# Altium project Battery_Board.PrjPcb
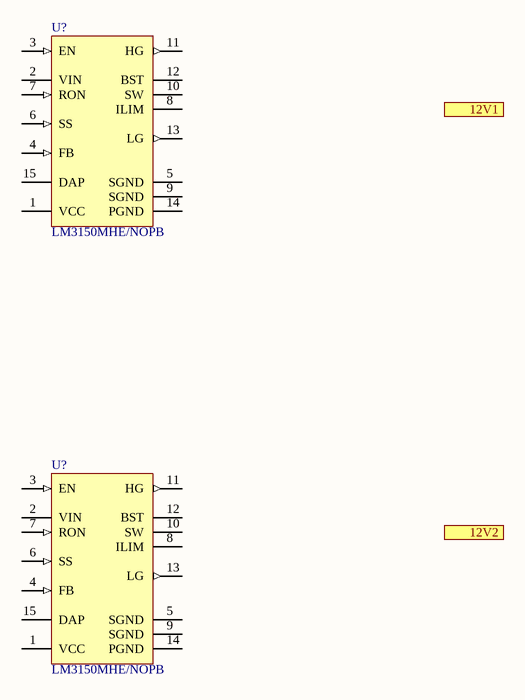
[diagram p0: 12V_Regulators.SchDoc]
6 sheets, 26 parts. Net scope: flat (ports and power ports of the same name join across sheets).
Sheets:
  BatteryBoardInterface.SchDoc
  12V_Regulators.SchDoc
  MCU.SchDoc
  BatteryProtection.SchDoc
  BatteryCharger.SchDoc
  IdealDiode.SchDoc

## Sheet BatteryBoardInterface.SchDoc
size A

## Sheet 12V_Regulators.SchDoc
size A

### Parts
(Parts that share a designator on the sheet are numbered #1, #2 ... from top to bottom, then left to right.)
U?#1  LM3150MHE/NOPB  [PWP0014A_L]
U?#2  LM3150MHE/NOPB  [PWP0014A_L]

### Ports
12V1 (out), 12V2 (out)

### Nets

Not connected (* = marked no-connect by the designer): U?#1 1(VCC) 2(VIN) 3(EN) 4(FB) 5(SGND) 6(SS) 7(RON) 8(ILIM) 9(SGND) 10(SW) 11(HG) 12(BST) 13(LG) 14(PGND) 15(DAP); U?#2 1(VCC) 2(VIN) 3(EN) 4(FB) 5(SGND) 6(SS) 7(RON) 8(ILIM) 9(SGND) 10(SW) 11(HG) 12(BST) 13(LG) 14(PGND) 15(DAP)

### Library data of the parts
U?#1 U?#2 = CMP-0069-01799-3: SIMPLE SWITCHER® CONTROLLER, 42V Synchronous Step-Down, 14-pin TSSOP-EP, Pb-Free; Manufacturer: Texas Instruments; PackageTopMarking: NSUZXYTT*LM3150*MH; PowerWise: Y; ComponentLink1URL: http://www.ti.com/general/docs/lit/getliterature.tsp?genericPartNumber=LM3150&fileType=pdf; PinCount: 14; RoHS: Y; PackageDescription: Molded TSSOP, JEDEC, Exposed Pad, 5.0 x 4.4 x 0.9mm Body, 14 Lead, 0.65mm Pitch; ComponentLink1Description: Datasheet URL; CompType: Switcher; PackageReference: PWP0014A; Code_JEDEC: MO-153-ABT-1

## Sheet MCU.SchDoc
size A
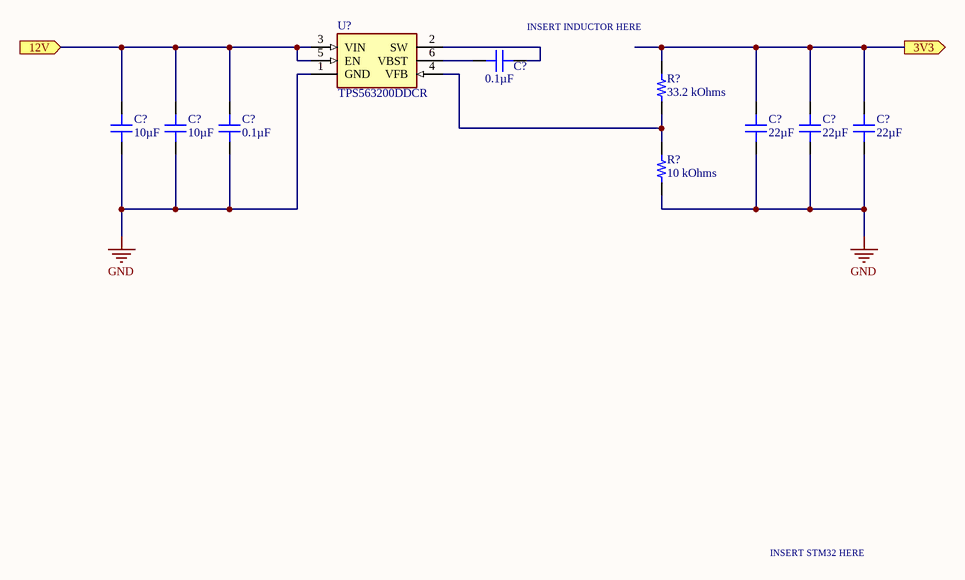
[diagram p1: MCU.SchDoc]

### Parts
(Parts that share a designator on the sheet are numbered #1, #2 ... from top to bottom, then left to right.)
C?#1  0.1µF  [CAP 0805_2012]
C?#2  10µF  [CAP 0805_2012]
C?#3  10µF  [CAP 0805_2012]
C?#4  0.1µF  [CAP 0805_2012]
C?#5  22µF  [CAP 0805_2012]
C?#6  22µF  [CAP 0805_2012]
C?#7  22µF  [CAP 0805_2012]
R?#1  33.2 kOhms  [RES 0603_1608]
R?#2  10 kOhms  [RES 0603_1608]
U?#3  TPS563200DDCR  [SOT95P280X110-6N]

### Ports
3V3 (out), 12V (in)

### Nets
GND: C?#2.1 C?#3.1 C?#4.1 C?#5.1 C?#6.1 C?#7.1 R?#2.1 U?#3.1(GND)
NetC?#1_1: C?#1.1 U?#3.6(VBST)
NetC?#1_2: C?#1.2 U?#3.2(SW)
NetC?#2_2: C?#2.2 C?#3.2 C?#4.2 U?#3.3(VIN) U?#3.5(EN) ; port 12V
NetC?#5_2: C?#5.2 C?#6.2 C?#7.2 R?#1.2 ; port 3V3
NetR?#1_1: R?#1.1 R?#2.2 U?#3.4(VFB)

### Notes on the sheet
- (near C?#1) INSERT INDUCTOR HERE
- INSERT STM32 HERE

### Library data of the parts
C?#1 C?#4 = UMK212B7104KG-T: CAP CER 0.1UF 50V X7R 0805; Manufacturer: Taiyo Yuden; Tolerance: ±10%; Part Number: UMK212B7104KG-T; Value: 0.1µF; Applications: General Purpose; Capacitance: 0.1µF; ComponentLink1Description: Datasheet; ComponentLink1URL: https://www.yuden.co.jp/productdata/catalog/mlcc01_e.pdf; ComponentLink2Description: DigiKey Link; ComponentLink2URL: http://digikey.com/product-detail/en/taiyo-yuden/UMK212B7104KG-T/587-1279-1-ND/931056; Device Package: 0805 (2012 Metric); LastUpdated: 1/21/2020 12:03:02 AM; Lifecycle Status: Active; Minimum Order: 1; Mounting Type: Surface Mount, MLCC; Operating Temperature: -55°C ~ 125°C; Package / Case: 0805 (2012 Metric); Packaging: TapeAndReel; PartId: 4985; Part Status: Active; Price: 0.02; Series: M; Size / Dimension: 0.079" L x 0.049" W (2.00mm x 1.25mm); Supplier 1: DigiKey; Supplier Part Number 1: 587-1279-1-ND; Temperature Coefficient: X7R; Thickness (Max): 0.053" (1.35mm); Voltage - Rated: 50V
C?#2 C?#3 = TMK212BBJ106KGHT: CAP CER 10UF 25V X5R 0805; Manufacturer: Taiyo Yuden; Tolerance: ±10%; Part Number: TMK212BBJ106KGHT; Value: 10µF; Applications: Automotive; Capacitance: 10µF; ComponentLink1Description: Datasheet; ComponentLink1URL: https://www.yuden.co.jp/productdata/catalog/mlcc_all_hq_e.pdf; ComponentLink2Description: DigiKey Link; ComponentLink2URL: http://digikey.com/product-detail/en/taiyo-yuden/TMK212BBJ106KGHT/587-4334-1-ND/5400908; Device Package: 0805 (2012 Metric); LastUpdated: 1/21/2020 12:03:03 AM; Lifecycle Status: Active; Minimum Order: 1; Mounting Type: Surface Mount, MLCC; Operating Temperature: -55°C ~ 85°C; Package / Case: 0805 (2012 Metric); Packaging: TapeAndReel; PartId: 4818; Part Status: Active; Price: 0.07; Ratings: AEC-Q200; Series: M; Size / Dimension: 0.079" L x 0.049" W (2.00mm x 1.25mm); Supplier 1: DigiKey; Supplier Part Number 1: 587-4334-1-ND; Temperature Coefficient: X5R; Thickness (Max): 0.053" (1.35mm); Voltage - Rated: 25V
C?#5-C?#7 = LMK212BBJ226MG-T: CAP CER 22UF 10V X5R 0805; Manufacturer: Taiyo Yuden; Tolerance: ±20%; Part Number: LMK212BBJ226MG-T; Value: 22µF; Applications: SMPS Filtering; Capacitance: 22µF; ComponentLink1Description: Datasheet; ComponentLink1URL: https://ds.yuden.co.jp/TYCOMPAS/ut/detail?pn=LMK212BBJ226MG-T &u=M; ComponentLink2Description: DigiKey Link; ComponentLink2URL: http://digikey.com/product-detail/en/taiyo-yuden/LMK212BBJ226MG-T/587-5464-1-ND/7067140; Device Package: 0805 (2012 Metric); LastUpdated: 1/21/2020 12:02:43 AM; Lifecycle Status: Active; Minimum Order: 1; Mounting Type: Surface Mount, MLCC; Operating Temperature: -55°C ~ 85°C; Package / Case: 0805 (2012 Metric); Packaging: TapeAndReel; PartId: 16243; Part Status: Active; Price: 0.06; Series: M; Size / Dimension: 0.079" L x 0.049" W (2.00mm x 1.25mm); Supplier 1: DigiKey; Supplier Part Number 1: 587-5464-1-ND; Temperature Coefficient: X5R; Thickness (Max): 0.057" (1.45mm); Voltage - Rated: 10V
R?#1 = RT0603FRE0733K2L: RES SMD 33.2K OHM 1% 1/10W 0603; Manufacturer: Yageo; Power (Watts): 0.1W, 1/10W; Temperature Coefficient: ±50ppm/°C; Part Number: RT0603FRE0733K2L; Value: 33.2 kOhms; ComponentLink1Description: Datasheet; ComponentLink1URL: https://www.yageo.com/upload/media/product/productsearch/datasheet/rchip/PYu-RT_1-to-0.01_RoHS_L_11.pdf; ComponentLink2Description: DigiKey Link; ComponentLink2URL: http://digikey.com/product-detail/en/yageo/RT0603FRE0733K2L/YAG5958CT-ND/9370988; Composition: Thin Film; Device Package: 0603 (1608 Metric); Height - Seated (Max): 0.022" (0.55mm); LastUpdated: 1/21/2020 12:20:29 AM; Lifecycle Status: Active; Minimum Order: 1; Number of Terminations: 2; Operating Temperature: -55°C ~ 155°C; Package / Case: 0603 (1608 Metric); Packaging: TapeAndReel; PartId: 16004; Part Status: Active; Price: 0.01; Resistance: 33.2 kOhms; Series: RT; Size / Dimension: 0.063" L x 0.031" W (1.60mm x 0.80mm); Supplier 1: DigiKey; Supplier Part Number 1: YAG5958CT-ND; Supplier Device Package: 0603; Tolerance: ±1%
R?#2 = TNPW060310K0FHTA: RES 10K OHM 1% 1/10W 0603; Manufacturer: Vishay Dale; Power (Watts): 0.1W, 1/10W; Temperature Coefficient: ±50ppm/°C; Part Number: TNPW060310K0FHTA; Value: 10 kOhms; ComponentLink2Description: DigiKey Link; ComponentLink2URL: http://digikey.com/product-detail/en/vishay-dale/TNPW060310K0FHTA/541-3906-1-ND/7355264; Composition: Thin Film; Device Package: 0603 (1608 Metric); Features: Military; Height - Seated (Max): 0.022" (0.55mm); LastUpdated: 1/21/2020 12:23:11 AM; Lifecycle Status: Active; Minimum Order: 1; Number of Terminations: 2; Operating Temperature: -55°C ~ 125°C; Package / Case: 0603 (1608 Metric); Packaging: TapeAndReel; PartId: 9361; Part Status: Active; Price: 0.07; Resistance: 10 kOhms; Series: TNPW; Size / Dimension: 0.063" L x 0.033" W (1.60mm x 0.85mm); Supplier 1: DigiKey; Supplier Part Number 1: 541-3906-1-ND; Supplier Device Package: 0603; Tolerance: ±1%
U?#3 = TPS563200DDCR: Buck Switching Regulator IC Positive Adjustable 0.76V 1 Output 3A SOT-23-6 Thin, TSOT-23-6; MF: Texas Instruments; Package: TSOT-23 Texas Instruments; Value: *; Price: None; MP: TPS563200DDCR; SnapEDA_Link: https://www.snapeda.com/parts/TPS563200DDCR/Texas%20Instruments/view-part/71685/?ref=snap; Availability: Unavailable

## Sheet BatteryProtection.SchDoc
size A

## Sheet BatteryCharger.SchDoc
size B
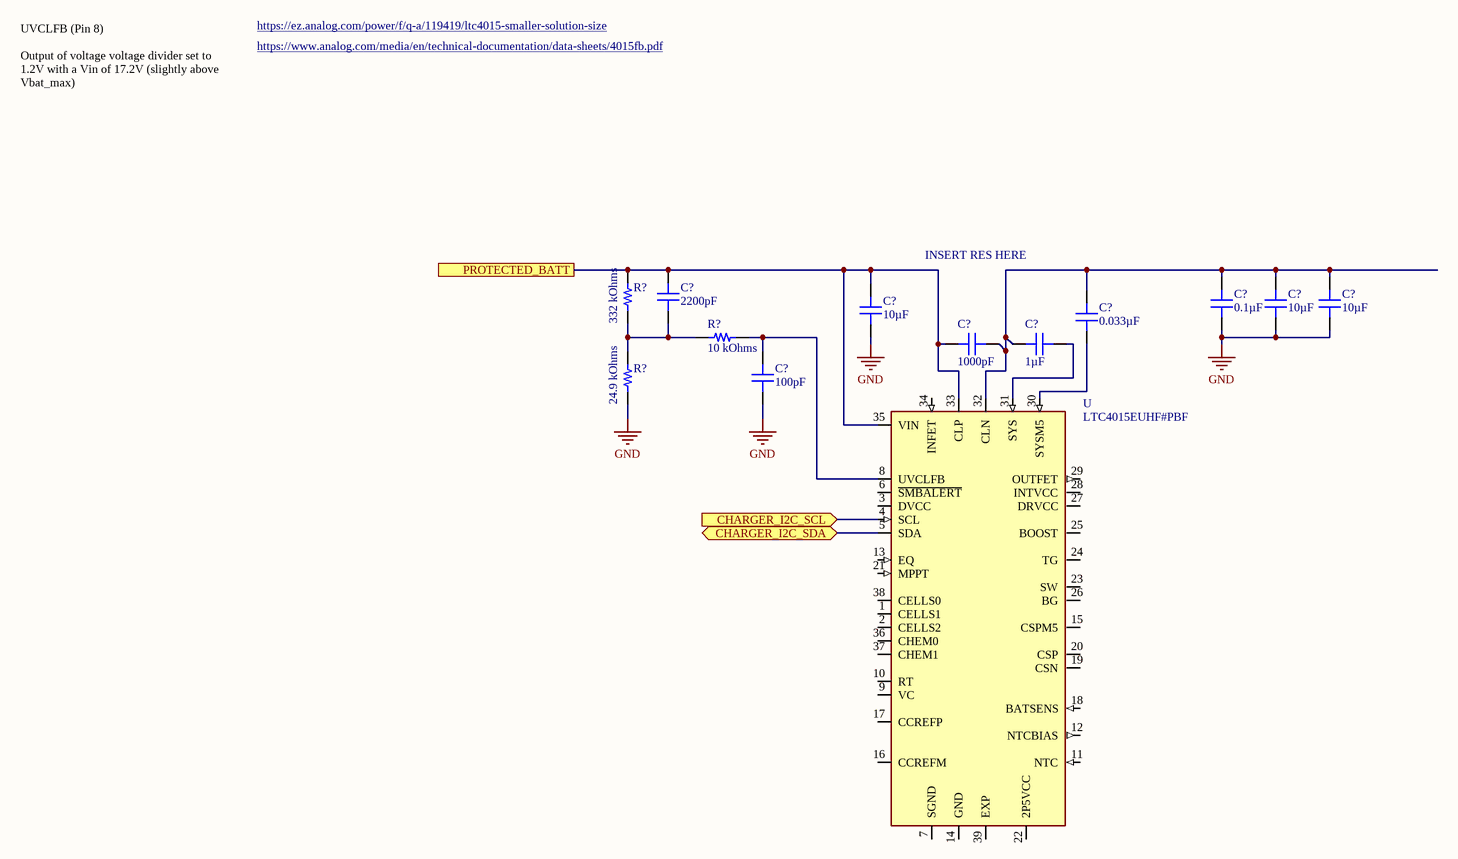
[diagram p2: BatteryCharger.SchDoc]

### Parts
(Parts that share a designator on the sheet are numbered #1, #2 ... from top to bottom, then left to right.)
C?#8  2200pF  [CAP 0603_1608]
C?#9  0.1µF  [CAP 0603_1608]
C?#10  10µF  [CAP 0805_2012]
C?#11  10µF  [CAP 0805_2012]
C?#12  10µF  [CAP 0805_2012]
C?#13  0.033µF  [CAP 0603_1608]
C?#14  1000pF  [CAP 0603_1608]
C?#15  1µF  [CAP 0603_1608]
C?#16  100pF  [CAP 0603_1608]
R?#3  332 kOhms  [RES 0603_1608]
R?#4  10 kOhms  [RES 0603_1608]
R?#5  24.9 kOhms  [RES 0603_1608]
U  LTC4015EUHF#PBF  [QFN50P700X500X80-39N]

### Ports
CHARGER_I2C_SCL (in), CHARGER_I2C_SDA (bidir), PROTECTED_BATT

### Nets
GND: C?#9.1 C?#10.1 C?#11.1 C?#12.1 C?#16.1 R?#5.1
NetC?#8_1: C?#8.1 R?#3.1 R?#4.1 R?#5.2
NetC?#8_2: C?#8.2 C?#12.2 C?#14.1 R?#3.2 U.33(CLP) U.35(VIN) ; port PROTECTED_BATT
NetC?#9_2: C?#9.2 C?#10.2 C?#11.2 C?#13.2 C?#14.2 C?#15.1 U.32(CLN)
NetC?#13_1: C?#13.1 U.30(SYSM5)
NetC?#15_2: C?#15.2 U.31(SYS)
NetC?#16_2: C?#16.2 R?#4.2 U.8(UVCLFB)
NetU_4: U.4(SCL) ; port CHARGER_I2C_SCL
NetU_5: U.5(SDA) ; port CHARGER_I2C_SDA

Not connected (* = marked no-connect by the designer): U 1(CELLS1) 2(CELLS2) 3(DVCC) 6(~{SMBALERT}) 7(SGND) 9(VC) 10(RT) 11(NTC) 12(NTCBIAS) 13(EQ) 14(GND) 15(CSPM5) 16(CCREFM) 17(CCREFP) 18(BATSENS) 19(CSN) 20(CSP) 21(MPPT) 22(2P5VCC) 23(SW) 24(TG) 25(BOOST) 26(BG) 27(DRVCC) 28(INTVCC) 29(OUTFET) 34(INFET) 36(CHEM0) 37(CHEM1) 38(CELLS0) 39(EXP)

### Notes on the sheet
- https://ez.analog.com/power/f/q-a/119419/ltc4015-smaller-solution-size
- https://www.analog.com/media/en/technical-documentation/data-sheets/4015fb.pdf
- UVCLFB (Pin 8)
  Output of voltage voltage divider set to 1.2V with a Vin of 17.2V (slightly above Vbat_max)
- INSERT RES HERE

### Library data of the parts
C?#8 = VJ0603Y222KXACW1BC: CAP CER 2200PF 50V X7R 0603; Manufacturer: Vishay Vitramon; Tolerance: ±10%; Part Number: VJ0603Y222KXACW1BC; Value: 2200pF; Applications: General Purpose; Capacitance: 2200pF; ComponentLink1Description: Datasheet; ComponentLink1URL: https://www.vishay.com/docs/28548/vjw1bcbascomseries.pdf; ComponentLink2Description: DigiKey Link; ComponentLink2URL: http://digikey.com/product-detail/en/vishay-vitramon/VJ0603Y222KXACW1BC/720-1600-1-ND/421005; Device Package: 0603 (1608 Metric); LastUpdated: 1/21/2020 12:01:49 AM; Lifecycle Status: Active; Minimum Order: 1; Mounting Type: Surface Mount, MLCC; Operating Temperature: -55°C ~ 125°C; Package / Case: 0603 (1608 Metric); Packaging: TapeAndReel; PartId: 14237; Part Status: Active; Price: 0.01; Series: VJ; Size / Dimension: 0.063" L x 0.031" W (1.60mm x 0.80mm); Supplier 1: DigiKey; Supplier Part Number 1: 720-1600-1-ND; Temperature Coefficient: X7R; Thickness (Max): 0.035" (0.90mm); Voltage - Rated: 50V
C?#9 = UMK107BJ104KAHT: CAP CER 0.1UF 50V X5R 0603; Manufacturer: Taiyo Yuden; Tolerance: ±10%; Part Number: UMK107BJ104KAHT; Value: 0.1µF; Applications: Automotive; Capacitance: 0.1µF; ComponentLink1Description: Datasheet; ComponentLink1URL: https://www.yuden.co.jp/productdata/catalog/mlcc06_hq_e.pdf; ComponentLink2Description: DigiKey Link; ComponentLink2URL: http://digikey.com/product-detail/en/taiyo-yuden/UMK107BJ104KAHT/587-3504-1-ND/4157267; Device Package: 0603 (1608 Metric); LastUpdated: 1/21/2020 12:02:06 AM; Lifecycle Status: Active; Minimum Order: 1; Mounting Type: Surface Mount, MLCC; Operating Temperature: -55°C ~ 85°C; Package / Case: 0603 (1608 Metric); Packaging: TapeAndReel; PartId: 4294; Part Status: Active; Price: 0.02; Ratings: AEC-Q200; Series: M; Size / Dimension: 0.063" L x 0.031" W (1.60mm x 0.80mm); Supplier 1: DigiKey; Supplier Part Number 1: 587-3504-1-ND; Temperature Coefficient: X5R; Thickness (Max): 0.035" (0.90mm); Voltage - Rated: 50V
C?#10-C?#12 = GRM21BC8YA106KE11L: CAP CER 10UF 35V X6S 0805; Manufacturer: Murata Electronics; Tolerance: ±10%; Part Number: GRM21BC8YA106KE11L; Value: 10µF; Applications: General Purpose; Capacitance: 10µF; ComponentLink1Description: Datasheet; ComponentLink1URL: https://search.murata.co.jp/Ceramy/image/img/A01X/G101/ENG/GRM21BC8YA106KE11-01.pdf; ComponentLink2Description: DigiKey Link; ComponentLink2URL: http://digikey.com/product-detail/en/murata-electronics/GRM21BC8YA106KE11L/490-10504-1-ND/5026432; Device Package: 0805 (2012 Metric); LastUpdated: 1/21/2020 12:02:43 AM; Lifecycle Status: Active; Minimum Order: 1; Mounting Type: Surface Mount, MLCC; Operating Temperature: -55°C ~ 105°C; Package / Case: 0805 (2012 Metric); Packaging: TapeAndReel; PartId: 16091; Part Status: Active; Price: 0.12; Series: GRM; Size / Dimension: 0.079" L x 0.049" W (2.00mm x 1.25mm); Supplier 1: DigiKey; Supplier Part Number 1: 490-10504-1-ND; Temperature Coefficient: X6S; Thickness (Max): 0.057" (1.45mm); Voltage - Rated: 35V
C?#13 = VJ0603Y333KXACW1BC: CAP CER 0.033UF 50V X7R 0603; Manufacturer: Vishay Vitramon; Tolerance: ±10%; Part Number: VJ0603Y333KXACW1BC; Value: 0.033µF; Applications: General Purpose; Capacitance: 0.033µF; ComponentLink1Description: Datasheet; ComponentLink1URL: https://www.vishay.com/docs/28548/vjw1bcbascomseries.pdf; ComponentLink2Description: DigiKey Link; ComponentLink2URL: http://digikey.com/product-detail/en/vishay-vitramon/VJ0603Y333KXACW1BC/720-1694-1-ND/8324114; Device Package: 0603 (1608 Metric); LastUpdated: 1/21/2020 12:02:00 AM; Lifecycle Status: Active; Minimum Order: 1; Mounting Type: Surface Mount, MLCC; Operating Temperature: -55°C ~ 125°C; Package / Case: 0603 (1608 Metric); Packaging: TapeAndReel; PartId: 8069; Part Status: Active; Price: 0.02; Series: VJ; Size / Dimension: 0.063" L x 0.031" W (1.60mm x 0.80mm); Supplier 1: DigiKey; Supplier Part Number 1: 720-1694-1-ND; Temperature Coefficient: X7R; Thickness (Max): 0.037" (0.95mm); Voltage - Rated: 50V
C?#14 = VJ0603Y102KXAPW1BC: CAP CER 1000PF 50V X7R 0603; Manufacturer: Vishay Vitramon; Tolerance: ±10%; Part Number: VJ0603Y102KXAPW1BC; Value: 1000pF; Applications: General Purpose; Capacitance: 1000pF; ComponentLink1Description: Datasheet; ComponentLink1URL: https://www.vishay.com/docs/28548/vjw1bcbascomseries.pdf; ComponentLink2Description: DigiKey Link; ComponentLink2URL: http://digikey.com/product-detail/en/vishay-vitramon/VJ0603Y102KXAPW1BC/720-VJ0603Y102KXAPW1BCCT-ND/11198400; Device Package: 0603 (1608 Metric); LastUpdated: 1/21/2020 12:01:34 AM; Lifecycle Status: Active; Minimum Order: 1; Mounting Type: Surface Mount, MLCC; Operating Temperature: -55°C ~ 125°C; Package / Case: 0603 (1608 Metric); Packaging: TapeAndReel; PartId: 26262; Part Status: Active; Price: 0.01; Series: VJ; Size / Dimension: 0.063" L x 0.031" W (1.60mm x 0.80mm); Supplier 1: DigiKey; Supplier Part Number 1: 720-VJ0603Y102KXAPW1BCCT-ND; Temperature Coefficient: X7R; Thickness (Max): 0.034" (0.87mm); Voltage - Rated: 50V
C?#15 = UMK107BJ105MA-T: CAP CER 1UF 50V X5R 0603; Manufacturer: Taiyo Yuden; Tolerance: ±20%; Part Number: UMK107BJ105MA-T; Value: 1µF; Applications: General Purpose; Capacitance: 1µF; ComponentLink1Description: Datasheet; ComponentLink1URL: https://www.yuden.co.jp/productdata/catalog/mlcc01_e.pdf; ComponentLink2Description: DigiKey Link; ComponentLink2URL: http://digikey.com/product-detail/en/taiyo-yuden/UMK107BJ105MA-T/587-5959-1-ND/7675079; Device Package: 0603 (1608 Metric); LastUpdated: 1/21/2020 12:01:54 AM; Lifecycle Status: Active; Minimum Order: 1; Mounting Type: Surface Mount, MLCC; Operating Temperature: -55°C ~ 85°C; Package / Case: 0603 (1608 Metric); Packaging: TapeAndReel; PartId: 11682; Part Status: Active; Price: 0.03; Series: M; Size / Dimension: 0.063" L x 0.031" W (1.60mm x 0.80mm); Supplier 1: DigiKey; Supplier Part Number 1: 587-5959-1-ND; Temperature Coefficient: X5R; Thickness (Max): 0.035" (0.90mm); Voltage - Rated: 50V
C?#16 = VJ0603Y101KXACW1BC: CAP CER 100PF 50V X7R 0603; Manufacturer: Vishay Vitramon; Tolerance: ±10%; Part Number: VJ0603Y101KXACW1BC; Value: 100pF; Applications: General Purpose; Capacitance: 100pF; ComponentLink1Description: Datasheet; ComponentLink1URL: https://www.vishay.com/docs/28548/vjw1bcbascomseries.pdf; ComponentLink2Description: DigiKey Link; ComponentLink2URL: http://digikey.com/product-detail/en/vishay-vitramon/VJ0603Y101KXACW1BC/720-1373-1-ND/3986127; Device Package: 0603 (1608 Metric); LastUpdated: 1/21/2020 12:01:52 AM; Lifecycle Status: Active; Minimum Order: 1; Mounting Type: Surface Mount, MLCC; Operating Temperature: -55°C ~ 125°C; Package / Case: 0603 (1608 Metric); Packaging: TapeAndReel; PartId: 13001; Part Status: Active; Price: 0.01; Series: VJ; Size / Dimension: 0.063" L x 0.031" W (1.60mm x 0.80mm); Supplier 1: DigiKey; Supplier Part Number 1: 720-1373-1-ND; Temperature Coefficient: X7R; Thickness (Max): 0.037" (0.95mm); Voltage - Rated: 50V
R?#3 = RMCF0603FT332K: RES 332K OHM 1% 1/10W 0603; Manufacturer: Stackpole Electronics Inc; Power (Watts): 0.1W, 1/10W; Temperature Coefficient: ±100ppm/°C; Part Number: RMCF0603FT332K; Value: 332 kOhms; ComponentLink1Description: Datasheet; ComponentLink1URL: https://www.seielect.com/catalog/sei-rmcf_rmcp.pdf; ComponentLink2Description: DigiKey Link; ComponentLink2URL: http://digikey.com/product-detail/en/stackpole-electronics-inc/RMCF0603FT332K/RMCF0603FT332KCT-ND/1943133; Composition: Thick Film; Device Package: 0603 (1608 Metric); Features: Automotive AEC-Q200; Height - Seated (Max): 0.022" (0.55mm); LastUpdated: 1/21/2020 12:22:37 AM; Lifecycle Status: Active; Minimum Order: 1; Number of Terminations: 2; Operating Temperature: -55°C ~ 155°C; Package / Case: 0603 (1608 Metric); Packaging: CutTape; PartId: 10657; Part Status: Active; Price: 0.10; Ratings: AEC-Q200; Resistance: 332 kOhms; Series: RMCF; Size / Dimension: 0.061" L x 0.031" W (1.55mm x 0.80mm); Supplier 1: DigiKey; Supplier Part Number 1: RMCF0603FT332KCT-ND; Supplier Device Package: 0603; Tolerance: ±1%
R?#4 = RNCP0603FTD10K0: RES 10K OHM 1% 1/8W 0603; Manufacturer: Stackpole Electronics Inc; Power (Watts): 0.125W, 1/8W; Temperature Coefficient: ±100ppm/°C; Part Number: RNCP0603FTD10K0; Value: 10 kOhms; ComponentLink1Description: Datasheet; ComponentLink1URL: https://www.seielect.com/catalog/sei-rncp.pdf; ComponentLink2Description: DigiKey Link; ComponentLink2URL: http://digikey.com/product-detail/en/stackpole-electronics-inc/RNCP0603FTD10K0/RNCP0603FTD10K0CT-ND/2240478; Composition: Thin Film; Device Package: 0603 (1608 Metric); Features: Anti-Sulfur, Moisture Resistant; Height - Seated (Max): 0.020" (0.50mm); LastUpdated: 1/21/2020 12:17:35 AM; Lifecycle Status: Active; Minimum Order: 1; Number of Terminations: 2; Operating Temperature: -55°C ~ 155°C; Package / Case: 0603 (1608 Metric); Packaging: TapeAndReel; PartId: 22616; Part Status: Active; Price: 0.01; Resistance: 10 kOhms; Series: RNCP; Size / Dimension: 0.059" L x 0.031" W (1.50mm x 0.80mm); Supplier 1: DigiKey; Supplier Part Number 1: RNCP0603FTD10K0CT-ND; Supplier Device Package: 0603; Tolerance: ±1%
R?#5 = RNCP0603FTD24K9: RES 24.9K OHM 1% 1/8W 0603; Manufacturer: Stackpole Electronics Inc; Power (Watts): 0.125W, 1/8W; Temperature Coefficient: ±100ppm/°C; Part Number: RNCP0603FTD24K9; Value: 24.9 kOhms; ComponentLink1Description: Datasheet; ComponentLink1URL: https://www.seielect.com/catalog/sei-rncp.pdf; ComponentLink2Description: DigiKey Link; ComponentLink2URL: http://digikey.com/product-detail/en/stackpole-electronics-inc/RNCP0603FTD24K9/RNCP0603FTD24K9CT-ND/2240491; Composition: Thin Film; Device Package: 0603 (1608 Metric); Features: Anti-Sulfur, Moisture Resistant; Height - Seated (Max): 0.020" (0.50mm); LastUpdated: 1/21/2020 12:24:38 AM; Lifecycle Status: Active; Minimum Order: 1; Number of Terminations: 2; Operating Temperature: -55°C ~ 155°C; Package / Case: 0603 (1608 Metric); Packaging: TapeAndReel; PartId: 5725; Part Status: Active; Price: 0.01; Resistance: 24.9 kOhms; Series: RNCP; Size / Dimension: 0.059" L x 0.031" W (1.50mm x 0.80mm); Supplier 1: DigiKey; Supplier Part Number 1: RNCP0603FTD24K9CT-ND; Supplier Device Package: 0603; Tolerance: ±1%
U = LTC4015EUHF#PBF: Charger IC Multi-Chemistry 38-QFN _5x7_; MF: Analog Devices; Price: None; SnapEDA_Link: https://www.snapeda.com/parts/LTC4015EUHF%23PBF/Analog%20Devices/view-part/2603016/?ref=snap; MP: LTC4015EUHF#PBF; Availability: Unavailable; Value: *; Package: QFN -38 Analog Devices

## Sheet IdealDiode.SchDoc
size A
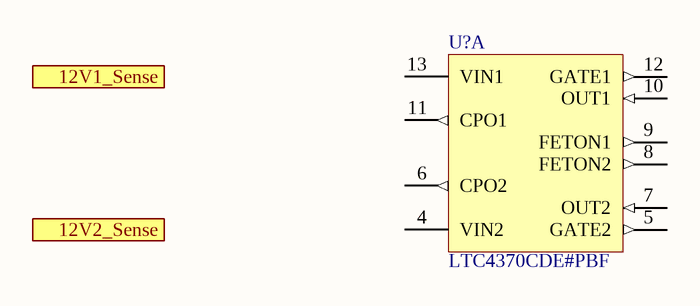
[diagram p3: IdealDiode.SchDoc]

### Parts
(Parts that share a designator on the sheet are numbered #1, #2 ... from top to bottom, then left to right.)
U?#4  LTC4370CDE#PBF  [LT-DE-16_V]  (part A of 2)

### Ports
12V1_Sense (in), 12V2_Sense (in)

### Nets

Not connected (* = marked no-connect by the designer): U?#4 4(VIN2) 5(GATE2) 6(CPO2) 7(OUT2) 8(FETON2) 9(FETON1) 10(OUT1) 11(CPO1) 12(GATE1) 13(VIN1)

### Library data of the parts
U?#4 = CMP-0479-00068-1: Two-Supply Diode-OR Current Balancing Controller, 0 to 18 V Vin, 16-pin SON (DE-16), 0 to 70 degC, Pb-Free; Manufacturer: Linear Technology; Ideal Diode: Dual, External, N-Channel; PackageReference: DE-16; PartNumber: LTC4370CDE#PBF; ComponentLink3URL: http://cds.linear.com/docs/en/packaging/DFN_16_05-08-1732.pdf; Code_JEDEC: MO-229; ComponentLink2URL: http://cds.linear.com/docs/en/datasheet/4370f.pdf; ComponentLink1URL: http://www.linear.com/; Mounting Technology: Surface Mount; ComponentLink2Description: Datasheet; ComponentLink1Description: Manufacturer URL; PackageVersion: Rev. Ã˜, 06/2010; RoHS: TRUE; ComponentLink3Description: Package Specification; PackageDescription: 16-Pin Plastic DFN, Body 4 x 3 mm, Pitch 0.45 mm

## Nets that join several sheets
GND: MCU (8 pins), BatteryCharger (6 pins)